# Altium schematic sheet [3]_SO-DIMM.SchDoc
size A3; DocumentNumber: 3; SheetNumber: 3; SheetTotal: 9; PageSetup: Record=PageOptions|CenterHorizontal=True|CenterVertical=True|PrintScale=0.97|XCorrection=1.00|YCorrection=1.00|PrintKind=1|BorderSize=5000000|LeftOffset=0|BottomOffset=0|Orientation=2|PaperLength=2970|PaperWidth=2100|Scale=100|PaperSource=7|PrintQuality=600|MediaType=1|DitherType=10|PaperKind=A4|PrintScaleMode=1
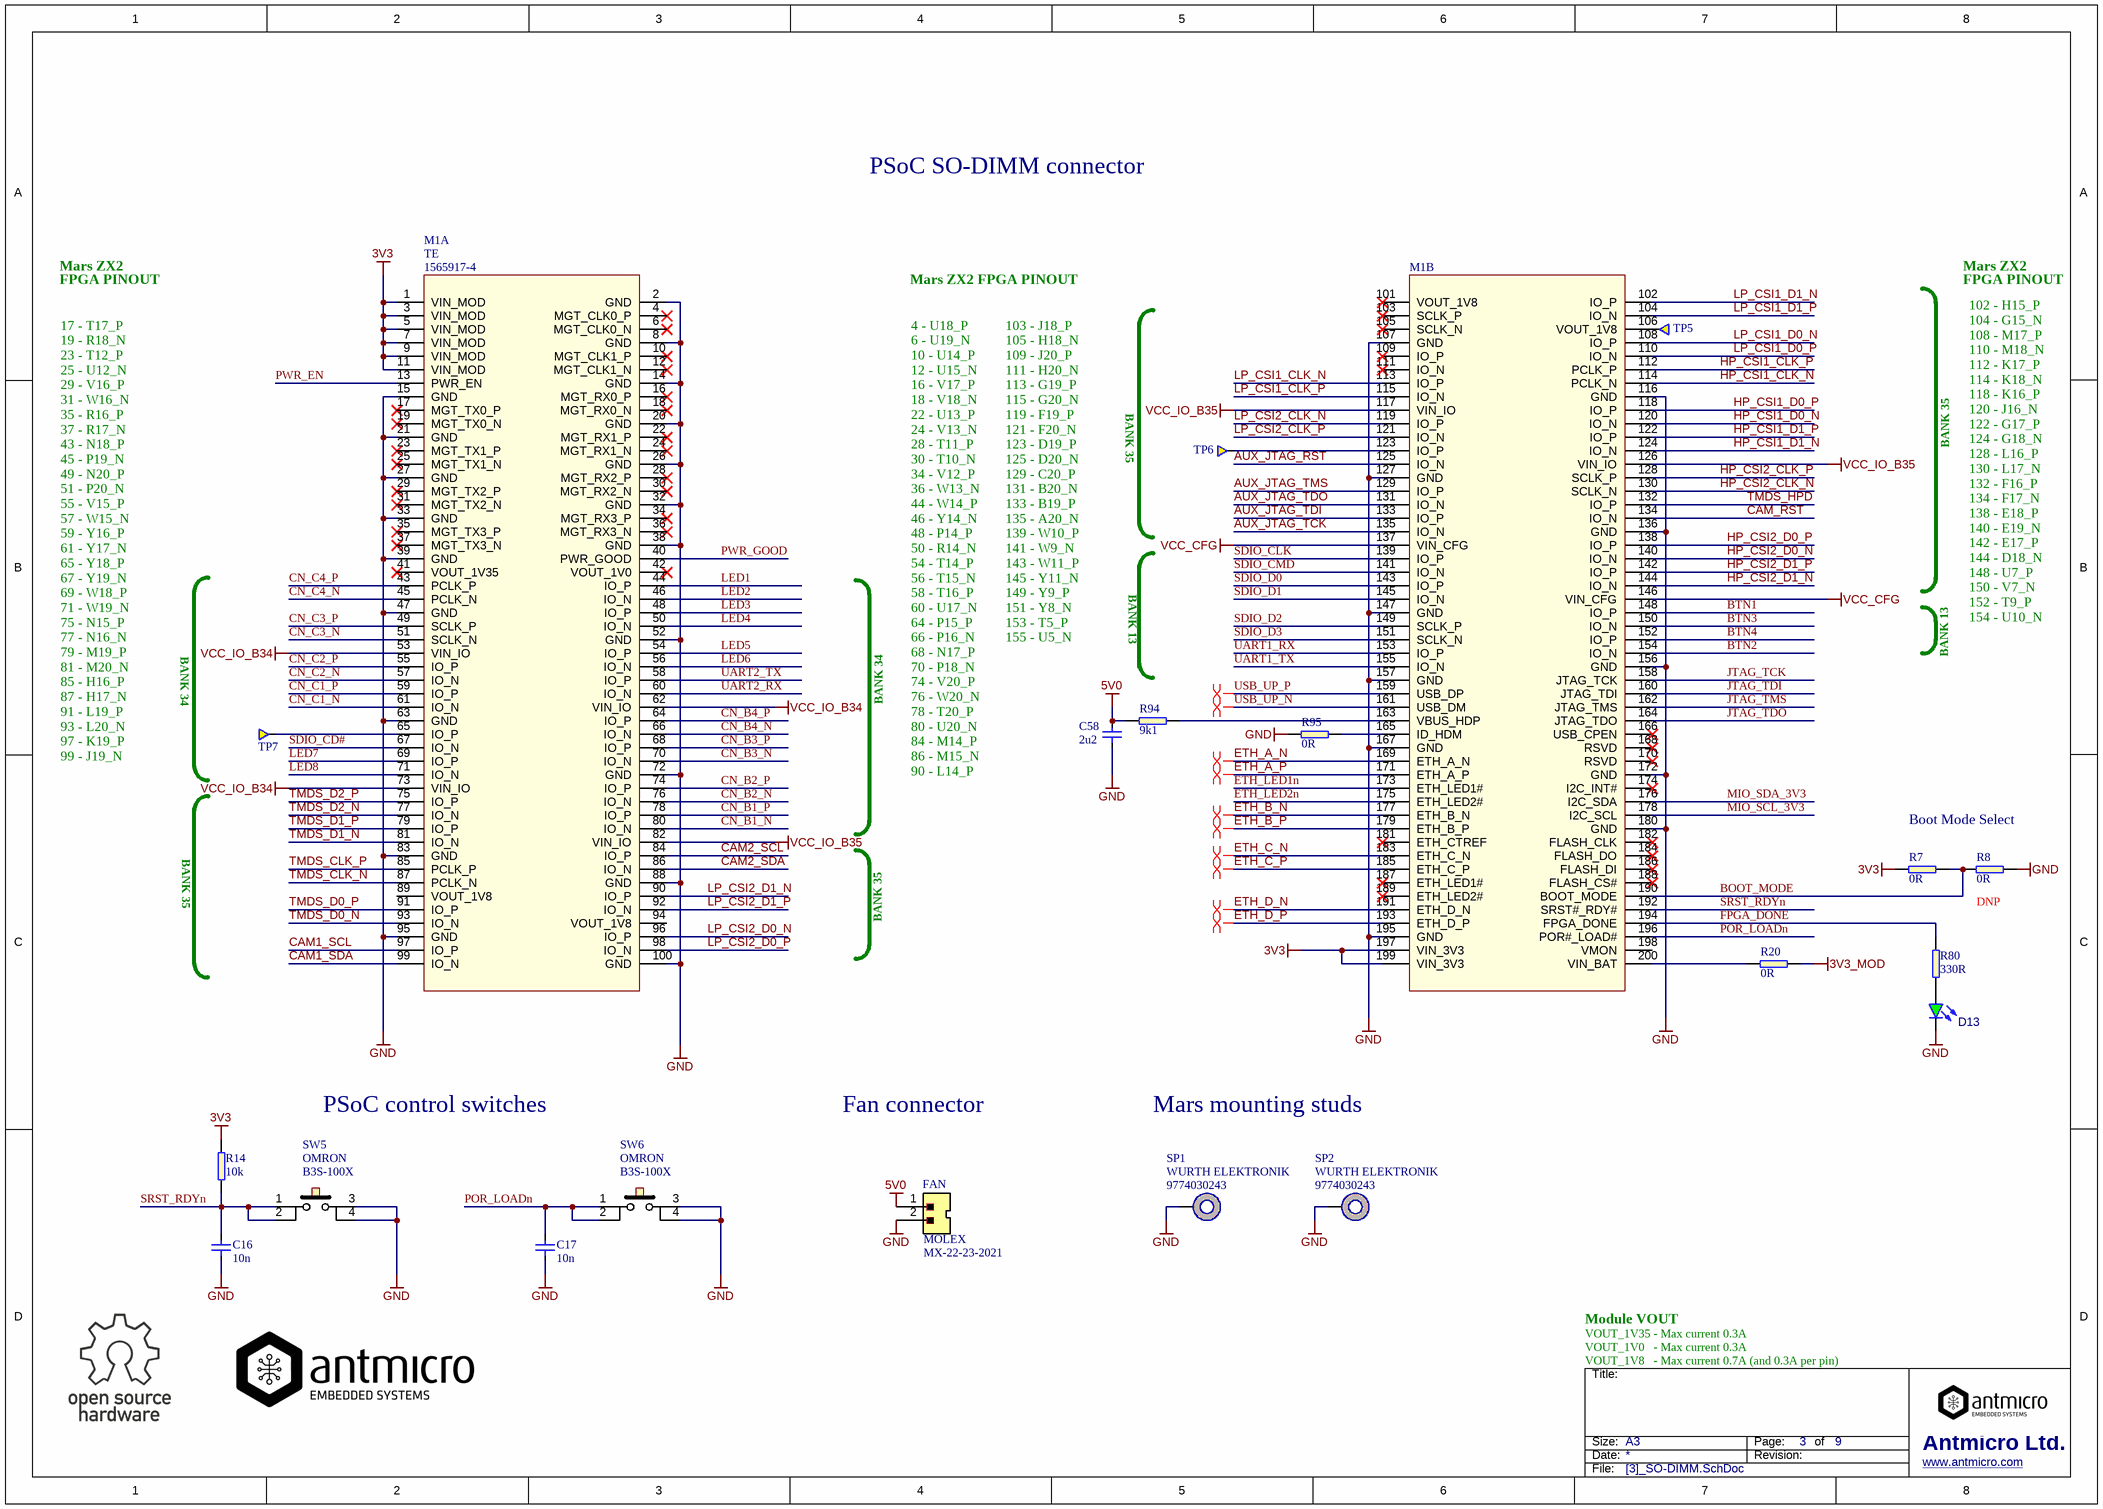
[diagram p0: [3]_SO-DIMM.SchDoc]

## Parts
C16  10n  [0402]
C17  10n  [0402]
C58  2u2  [0603]
D13  KPT-1608SGC  [LED0603]  (value not drawn)
FAN  Manufacturer: MOLEX  [molex_2223-2021]  (hidden comment: MX-22-23-2021)
M1  Manufacturer: TE  [TE_1565917-4]  (hidden comment: 1565917-4)  (parts A,B of 2)
R7  0R  [0402]
R8  0R  [0402]
R14  10k  [0402]
R20  0R  [0402]
R80  330R  [0402]
R94  9k1  [0402]
R95  0R  [0402]
SP1  9774030243  Manufacturer: WURTH ELEKTRONIK  [M2-3mm]
SP2  9774030243  Manufacturer: WURTH ELEKTRONIK  [M2-3mm]
SW5  Manufacturer: OMRON  [B3S-100X]  (hidden comment: B3S-100X)
SW6  Manufacturer: OMRON  [B3S-100X]  (hidden comment: B3S-100X)
TP5  Testpad  [TP-R-2]  (value not drawn)  (no BOM)
TP6  Testpad  [TP-R-2]  (value not drawn)  (no BOM)
TP7  Testpad  [TP-R-2]  (value not drawn)  (no BOM)

## Nets
3V3: M1.1(VIN_MOD) M1.3(VIN_MOD) M1.5(VIN_MOD) M1.7(VIN_MOD) M1.9(VIN_MOD) M1.11(VIN_MOD) M1.197(VIN_3V3) M1.199(VIN_3V3) R7.1 R14.1
3V3_MOD: R20.2
5V0: C58.2 FAN.1 R94.1
GND: C16.1 C17.1 C58.1 D13.K FAN.2 M1.2(GND) M1.8(GND) M1.14(GND) M1.15(GND) M1.20(GND) M1.21(GND) M1.26(GND) M1.27(GND) M1.32(GND) M1.33(GND) M1.38(GND) M1.39(GND) M1.47(GND) M1.52(GND) M1.63(GND) M1.72(GND) M1.83(GND) M1.88(GND) M1.95(GND) M1.100(GND) M1.107(GND) M1.116(GND) M1.127(GND) M1.136(GND) M1.147(GND) M1.156(GND) M1.157(GND) M1.167(GND) M1.172(GND) M1.180(GND) M1.195(GND) R8.2 R95.1 SP1.1 SP2.1 SW5.3 SW5.4 SW6.3 SW6.4
VCC_CFG: M1.137(VIN_CFG) M1.146(VIN_CFG)
VCC_IO_B34: M1.53(VIN_IO) M1.62(VIN_IO) M1.73(VIN_IO)
VCC_IO_B35: M1.82(VIN_IO) M1.117(VIN_IO) M1.126(VIN_IO)
AUX_JTAG_RST: M1.125(IO_N)
AUX_JTAG_TCK: M1.135(IO_N)
AUX_JTAG_TDI: M1.133(IO_P)
AUX_JTAG_TDO: M1.131(IO_N)
AUX_JTAG_TMS: M1.129(IO_P)
BOOT_MODE: M1.190(BOOT_MODE) R7.2 R8.1
BTN1: M1.148(IO_P)
BTN2: M1.154(IO_N)
BTN3: M1.150(IO_N)
BTN4: M1.152(IO_P)
CAM1_SCL: M1.97(IO_P)
CAM1_SDA: M1.99(IO_N)
CAM2_SCL: M1.84(IO_P)
CAM2_SDA: M1.86(IO_N)
CAM_RST: M1.134(IO_N)
CN_B1_N: M1.80(IO_N)
CN_B1_P: M1.78(IO_P)
CN_B2_N: M1.76(IO_N)
CN_B2_P: M1.74(IO_P)
CN_B3_N: M1.70(IO_N)
CN_B3_P: M1.68(IO_P)
CN_B4_N: M1.66(IO_N)
CN_B4_P: M1.64(IO_P)
CN_C1_N: M1.61(IO_N)
CN_C1_P: M1.59(IO_P)
CN_C2_N: M1.57(IO_N)
CN_C2_P: M1.55(IO_P)
CN_C3_N: M1.51(SCLK_N)
CN_C3_P: M1.49(SCLK_P)
CN_C4_N: M1.45(PCLK_N)
CN_C4_P: M1.43(PCLK_P)
ETH_A_N: M1.169(ETH_A_N)
ETH_A_P: M1.171(ETH_A_P)
ETH_B_N: M1.177(ETH_B_N)
ETH_B_P: M1.179(ETH_B_P)
ETH_C_N: M1.183(ETH_C_N)
ETH_C_P: M1.185(ETH_C_P)
ETH_D_N: M1.191(ETH_D_N)
ETH_D_P: M1.193(ETH_D_P)
ETH_LED1n: M1.173(ETH_LED1#)
ETH_LED2n: M1.175(ETH_LED2#)
FPGA_DONE: M1.194(FPGA_DONE) R80.2
HP_CSI1_CLK_N: M1.114(PCLK_N)
HP_CSI1_CLK_P: M1.112(PCLK_P)
HP_CSI1_D0_N: M1.120(IO_N)
HP_CSI1_D0_P: M1.118(IO_P)
HP_CSI1_D1_N: M1.124(IO_N)
HP_CSI1_D1_P: M1.122(IO_P)
HP_CSI2_CLK_N: M1.130(SCLK_N)
HP_CSI2_CLK_P: M1.128(SCLK_P)
HP_CSI2_D0_N: M1.140(IO_N)
HP_CSI2_D0_P: M1.138(IO_P)
HP_CSI2_D1_N: M1.144(IO_N)
HP_CSI2_D1_P: M1.142(IO_P)
JTAG_TCK: M1.158(JTAG_TCK)
JTAG_TDI: M1.160(JTAG_TDI)
JTAG_TDO: M1.164(JTAG_TDO)
JTAG_TMS: M1.162(JTAG_TMS)
LED1: M1.44(IO_P)
LED2: M1.46(IO_N)
LED3: M1.48(IO_P)
LED4: M1.50(IO_N)
LED5: M1.54(IO_P)
LED6: M1.56(IO_N)
LED7: M1.69(IO_P)
LED8: M1.71(IO_N)
LP_CSI1_CLK_N: M1.113(IO_P)
LP_CSI1_CLK_P: M1.115(IO_N)
LP_CSI1_D0_N: M1.108(IO_P)
LP_CSI1_D0_P: M1.110(IO_N)
LP_CSI1_D1_N: M1.102(IO_P)
LP_CSI1_D1_P: M1.104(IO_N)
LP_CSI2_CLK_N: M1.119(IO_P)
LP_CSI2_CLK_P: M1.121(IO_N)
LP_CSI2_D0_N: M1.96(IO_P)
LP_CSI2_D0_P: M1.98(IO_N)
LP_CSI2_D1_N: M1.90(IO_P)
LP_CSI2_D1_P: M1.92(IO_N)
MIO_SCL_3V3: M1.178(I2C_SCL)
MIO_SDA_3V3: M1.176(I2C_SDA)
POR_LOADn: C17.2 M1.196(POR#_LOAD#) SW6.1 SW6.2
PWR_EN: M1.13(PWR_EN)
PWR_GOOD: M1.40(PWR_GOOD)
SDIO_CD#: M1.67(IO_N)
SDIO_CLK: M1.139(IO_P)
SDIO_CMD: M1.141(IO_N)
SDIO_D0: M1.143(IO_P)
SDIO_D1: M1.145(IO_N)
SDIO_D2: M1.149(SCLK_P)
SDIO_D3: M1.151(SCLK_N)
SRST_RDYn: C16.2 M1.192(SRST#_RDY#) R14.2 SW5.1 SW5.2
TMDS_CLK_N: M1.87(PCLK_N)
TMDS_CLK_P: M1.85(PCLK_P)
TMDS_D0_N: M1.93(IO_N)
TMDS_D0_P: M1.91(IO_P)
TMDS_D1_N: M1.81(IO_N)
TMDS_D1_P: M1.79(IO_P)
TMDS_D2_N: M1.77(IO_N)
TMDS_D2_P: M1.75(IO_P)
TMDS_HPD: M1.132(IO_P)
UART1_RX: M1.153(IO_P)
UART1_TX: M1.155(IO_N)
UART2_RX: M1.60(IO_N)
UART2_TX: M1.58(IO_P)
USB_UP_N: M1.161(USB_DM)
USB_UP_P: M1.159(USB_DP)
NetD13_A: D13.A R80.1
NetM1_65: M1.65(IO_P) TP7.1
NetM1_106: M1.106(VOUT_1V8) TP5.1
NetM1_123: M1.123(IO_P) TP6.1
NetM1_163: M1.163(VBUS_HDP) R94.2
NetM1_165: M1.165(ID_HDM) R95.2
NetM1_200: M1.200(VIN_BAT) R20.1

Not connected (* = marked no-connect by the designer): M1 4(MGT_CLK0_P)* 6(MGT_CLK0_N)* 10(MGT_CLK1_P)* 12(MGT_CLK1_N)* 16(MGT_RX0_P)* 17(MGT_TX0_P)* 18(MGT_RX0_N)* 19(MGT_TX0_N)* 22(MGT_RX1_P)* 23(MGT_TX1_P)* 24(MGT_RX1_N)* 25(MGT_TX1_N)* 28(MGT_RX2_P)* 29(MGT_TX2_P)* 30(MGT_RX2_N)* 31(MGT_TX2_N)* 34(MGT_RX3_P)* 35(MGT_TX3_P)* 36(MGT_RX3_N)* 37(MGT_TX3_N)* 41(VOUT_1V35)* 42(VOUT_1V0)* 89(VOUT_1V8) 94(VOUT_1V8) 101(VOUT_1V8)* 103(SCLK_P)* 105(SCLK_N)* 109(IO_P)* 111(IO_N)* 166(USB_CPEN)* 168(RSVD)* 170(RSVD)* 174(I2C_INT#)* 181(ETH_CTREF)* 182(FLASH_CLK)* 184(FLASH_DO)* 186(FLASH_DI)* 187(ETH_LED1#)* 188(FLASH_CS#)* 189(ETH_LED2#)* 198(VMON)

## Layout directives
differential pair: ETH_A_N, ETH_A_P, ETH_B_N, ETH_B_P, ETH_C_N, ETH_C_P, ETH_D_N, ETH_D_P, USB_UP_N, USB_UP_P

## Notes on the sheet
- PSoC SO-DIMM connector
- Mars ZX2
- FPGA PINOUT
- Mars ZX2 FPGA PINOUT
- BANK 35
- BANK 34
- BANK 13
- 102 - H15_P
  104 - G15_N
  108 - M17_P
  110 - M18_N
  112 - K17_P
  114 - K18_N
  118 - K16_P
  120 - J16_N
  122 - G17_P
  124 - G18_N
  128 - L16_P
  130 - L17_N
  132 - F16_P
  134 - F17_N
  138 - E18_P
  140 - E19_N
  142 - E17_P
  144 - D18_N
  148 - U7_P
  150 - V7_N
  152 - T9_P
  154 - U10_N
- 17 - T17_P
  19 - R18_N
  23 - T12_P
  25 - U12_N
  29 - V16_P
  31 - W16_N
  35 - R16_P
  37 - R17_N
  43 - N18_P
  45 - P19_N
  49 - N20_P
  51 - P20_N
  55 - V15_P
  57 - W15_N
  59 - Y16_P
  61 - Y17_N
  65 - Y18_P
  67 - Y19_N
  69 - W18_P
  71 - W19_N
  75 - N15_P
  77 - N16_N
  79 - M19_P
  81 - M20_N
  85 - H16_P
  87 - H17_N
  91 - L19_P
  93 - L20_N
  97 - K19_P
  99 - J19_N
- 4 - U18_P
  6 - U19_N
  10 - U14_P
  12 - U15_N
  16 - V17_P
  18 - V18_N
  22 - U13_P
  24 - V13_N
  28 - T11_P
  30 - T10_N
  34 - V12_P
  36 - W13_N
  44 - W14_P
  46 - Y14_N
  48 - P14_P
  50 - R14_N
  54 - T14_P
  56 - T15_N
  58 - T16_P
  60 - U17_N
  64 - P15_P
  66 - P16_N
  68 - N17_P
  70 - P18_N
  74 - V20_P
  76 - W20_N
  78 - T20_P
  80 - U20_N
  84 - M14_P
  86 - M15_N
  90 - L14_P
  92 - L15_N
  96 - K14_P
  98 - J14_N
- (near C58) 103 - J18_P
  105 - H18_N
  109 - J20_P
  111 - H20_N
  113 - G19_P
  115 - G20_N
  119 - F19_P
  121 - F20_N
  123 - D19_P
  125 - D20_N
  129 - C20_P
  131 - B20_N
  133 - B19_P
  135 - A20_N
  139 - W10_P
  141 - W9_N
  143 - W11_P
  145 - Y11_N
  149 - Y9_P
  151 - Y8_N
  153 - T5_P
  155 - U5_N
- Boot Mode Select
- (near R8) DNP
- PSoC control switches
- Fan connector
- Mars mounting studs
- Module VOUT
- VOUT_1V35 - Max current 0.3A
- VOUT_1V0   - Max current 0.3A
- VOUT_1V8   - Max current 0.7A (and 0.3A per pin)
- Title:
- Size:
- Date:
- A3
- Revision:
- Page:
- of
- Antmicro Ltd.
- File:
- www.antmicro.com

## Library data of the parts
C16 C17 = C_10n_0402: MLCC SMT Capacitor 10nF 0402; Manufacturer: AVX; Part Symbol: 04025G103ZAT2A; Voltage: 50V; Tolerance: +80% -20%; Part Number: C_10n_0402; Value: 10n
C58 = C_2u2_0603: MLCC SMT Capacitor 2u2F 0603; Manufacturer: TDK; Part Symbol: C1608X5R1V225K080AC; Voltage: 35V; Tolerance: +-10%; Part Number: C_2u2_0603; Value: 2u2
D13 = LED: LED Green 0603 case; Part Number: LED_G; Manufacturer: KINGBRIGHT; Value: KPT-1608SGC; Part Symbol: KPT-1608SGC
FAN = molex_2223-2021: Pinhead connector with key; Part Symbol: 022232021 A-6373-02A222; Part Number: molex_2223-2021; Value: MX-22-23-2021
M1 = Mars ZX2: SODIMM Connector 200_1V8; Part Number: Mars ZX2; Part Symbol: 1565917-4; Value: 1565917-4
R7 R8 R20 R95 = R_0R_0402: SMT Resistor 0R 0402; Manufacturer: MULTICOMP; Part Symbol: MCMR04X000 PTL; Part Number: R_0R_0402; Value: 0R
R14 = R_10k_0402: SMT Resistor 10k 0402; Manufacturer: MULTICOMP; Part Symbol: MCMR04X1002FTL; Tolerance: 1%; Part Number: R_10k_0402; Value: 10k
R80 = R_330R_0402: SMT Resistor 330R 0402; Manufacturer: MULTICOMP; Part Symbol: MCMR04X3300FTL; Tolerance: 1%; Part Number: R_330R_0402; Value: 330R
R94 = R_9k1_0402: SMT Resistor 9k1 0402; Manufacturer: YAGEO; Part Symbol: RC0402FR-079K1L; Tolerance: 1%; Part Number: R_9k1_0402; Value: 9k1
SP1 SP2 = SPACER: M2x3; Part Number: WE_9774030243; Value: 9774030243; Part Symbol: 9774030243
SW5 SW6 = TACTILE_SWITCH: Tactile switch; Part Number: B3S-1002; Value: B3S-100X; Part Symbol: B3S-1002
TP5-TP7 = Testpad: Testpad, round, 2mm; Part Number: TP-R-2